# EAGLE design DDC118_eval2_rev1F (EAGLE 7.3.0)
Assembly variants: low-on-parts
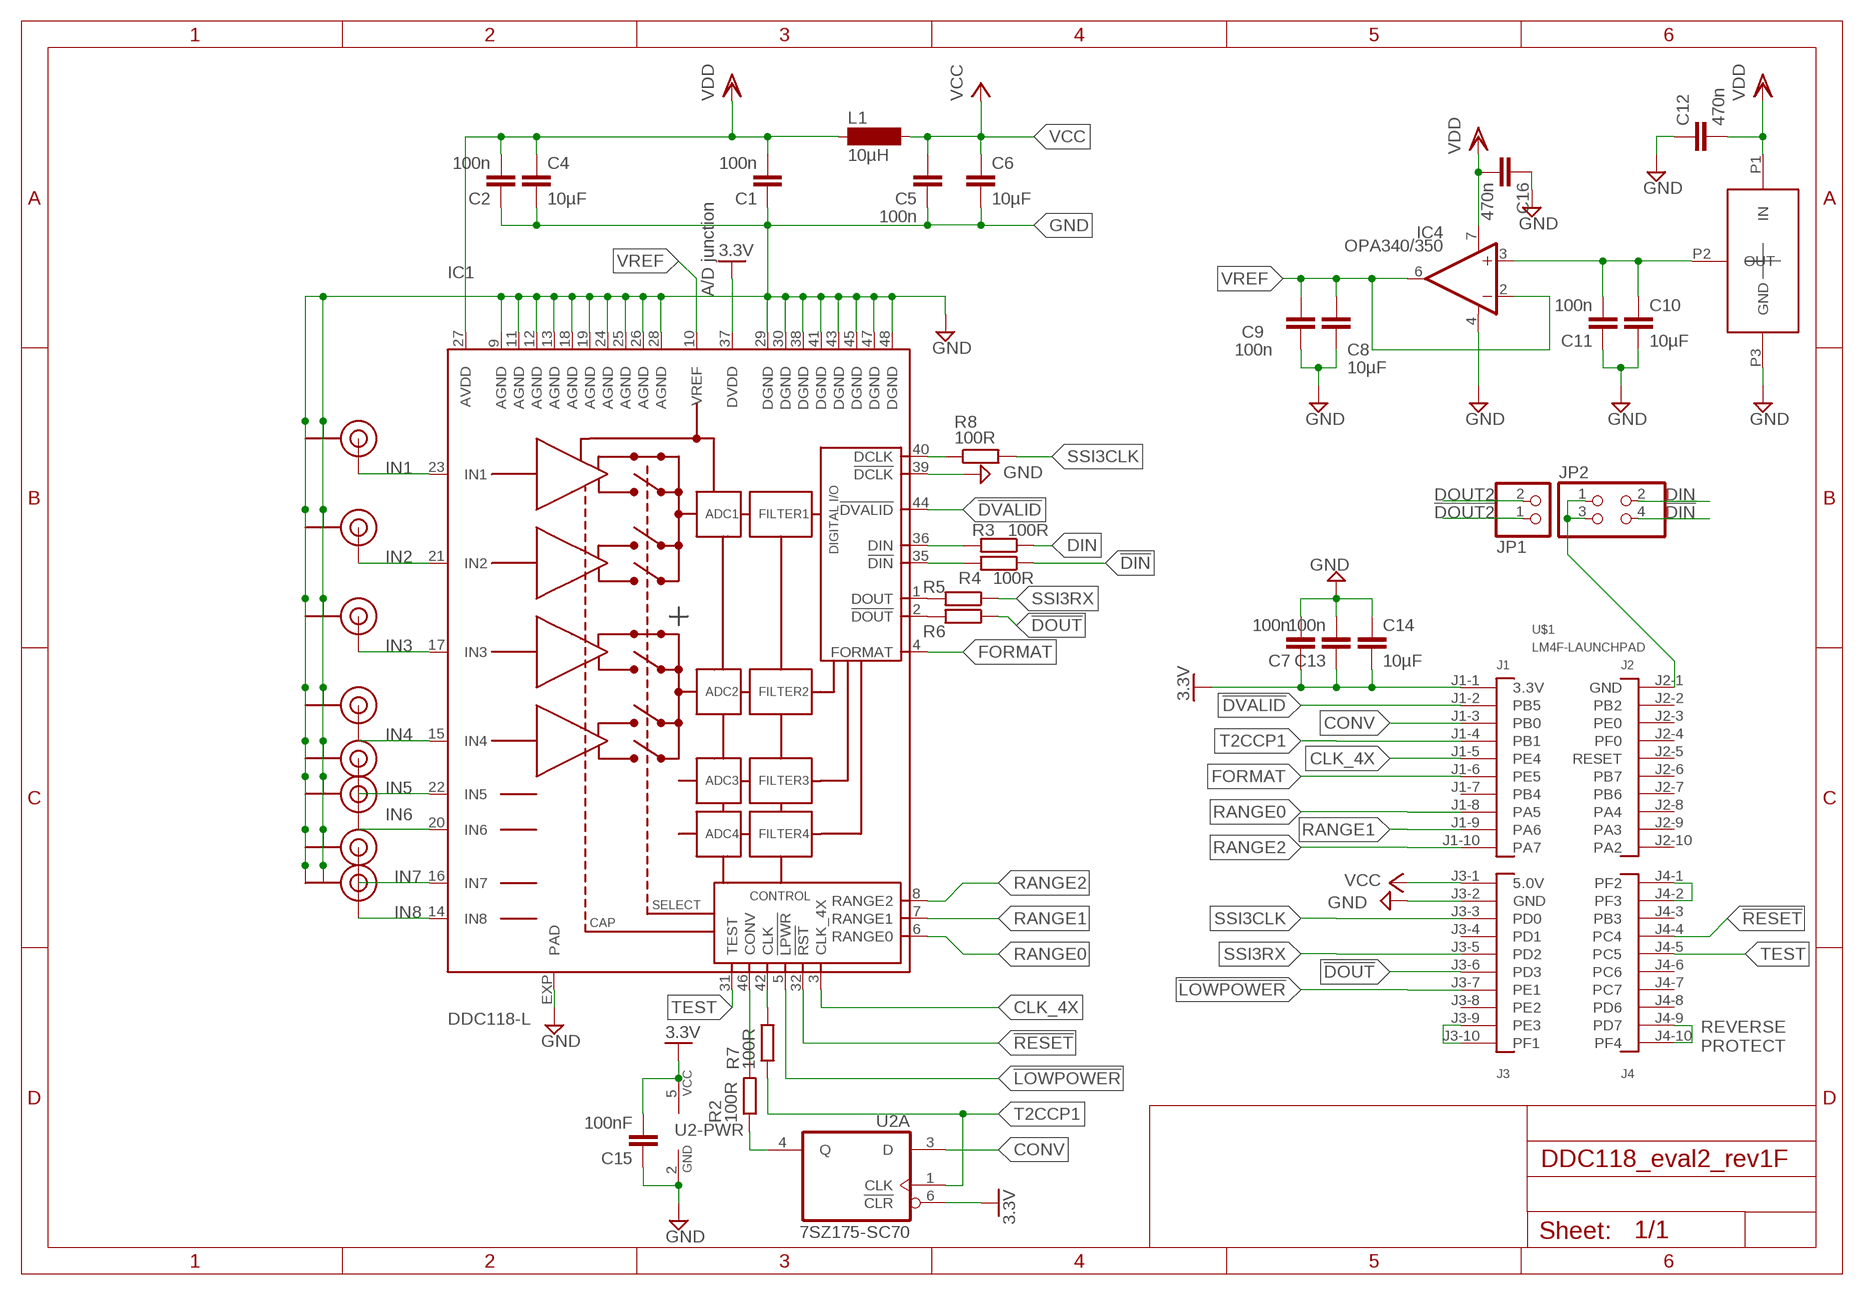
[diagram p0: schematic, sheet 1]

## Parts
C1  100n  C-EUC0805K  [C0805K]  (not fitted in variant low-on-parts)
C2  100n  C-EUC0805K  [C0805K]  (not fitted in variant low-on-parts)
C4  10µF  C-EUC0805  [C0805]  (variant low-on-parts: 4µ7)
C5  100n  C-EUC0805K  [C0805K]
C6  10µF  C-EUC0805  [C0805]  (not fitted in variant low-on-parts)
C7  100n  C-EUC0805K  [C0805K]
C8  10µF  C-EUC0805  [C0805]  (variant low-on-parts: 4µ7)
C9  100n  C-EUC0805K  [C0805K]  (not fitted in variant low-on-parts)
C10  10µF  C-EUC0805  [C0805]  (not fitted in variant low-on-parts)
C11  100n  C-EUC0805K  [C0805K]
C12  470n  C-EUC0805K  [C0805K]
C13  100n  C-EUC0805K  [C0805K]  (variant low-on-parts: 470n)
C14  10µF  C-EUC0805  [C0805]  (variant low-on-parts: 4µ7)
C15  100nF  C-EUC0603K  [C0603K]
C16  470n  CAP0805  [0805]
IC1  DDC118-L  [VQFN48-L]
IC4  OPA340/350  OPA340U  [SO08]
JP1  PINHD-1X2_2.54-SMD  [1X02SMD]
JP2  PINHD-2X2_2.54-SMD  [2X02SMD]
L1  10µH  MS50  [MS50]
R2  100R  R-EU_R0402  [R0402]
R3  100R  R-EU_R0402  [R0402]
R4  100R  R-EU_R0402  [R0402]
R5  100R  R-EU_R0402  [R0402]
R6  100R  R-EU_R0402  [R0402]
R7  100R  R-EU_R0402  [R0402]
R8  100R  R-EU_R0402  [R0402]
U1  REF30XX  [SOT-23]
U2  7SZ175-SC70  [SC-70]
U$1  LM4F-LAUNCHPAD  [LM4F120-LAUNCHPAD]
U$4  U.FL  [U.FL]
U$5  U.FL  [U.FL]
U$6  U.FL  [U.FL]
U$7  U.FL  [U.FL]
U$8  U.FL  [U.FL]
U$9  U.FL  [U.FL]
U$10  U.FL  [U.FL]
U$11  U.FL  [U.FL]

## Nets
!DIN: JP2.4 R4.1
!DOUT: R6.1 U$1.J3-6(PD3)
!DOUT2: JP1.1
!DVALID: IC1.44(!DVALID) U$1.J1-2(PB5)
!LOWPOWER: IC1.5(!LPWR) U$1.J3-7(PE1)
!RESET: IC1.32(!RST) U$1.J4-4(PC4)
+3.3V: C7.1 C13.1 C14.2 C15.2 IC1.37(DVDD) U2.5(-PWR:VCC) U2.6(A:!CLR) U$1.J1-1(3.3V) ; supply symbol labelled 3.3V
CLK_4X: IC1.3(CLK_4X) U$1.J1-5(PE4)
CONV: U2.3(A:D) U$1.J1-3(PB0)
CONV_LATCHED: IC1.46(CONV) R2.2
DIN: JP2.2 R3.1
DOUT2: JP1.2
FORMAT: IC1.4(FORMAT) U$1.J1-6(PE5)
GND: C1.1 C2.1 C4.2 C5.1 C6.2 C7.2 C8.2 C9.1 C10.2 C11.1 C12.1 C13.2 C14.1 C15.1 C16.1 IC1.9(AGND) IC1.11(AGND) IC1.12(AGND) IC1.13(AGND) IC1.18(AGND) IC1.19(AGND) IC1.24(AGND) IC1.25(AGND) IC1.26(AGND) IC1.28(AGND) IC1.29(DGND) IC1.30(DGND) IC1.38(DGND) IC1.39(!DCLK) IC1.41(DGND) IC1.43(DGND) IC1.45(DGND) IC1.47(DGND) IC1.48(DGND) IC1.EXP(PAD) IC4.4(V-) U1.P3(GND) U2.2(-PWR:GND) U$1.J3-2(GND) U$4.P$1(GND) U$4.P$2(GND) U$5.P$1(GND) U$5.P$2(GND) U$6.P$1(GND) U$6.P$2(GND) U$7.P$1(GND) U$7.P$2(GND) U$8.P$1(GND) U$8.P$2(GND) U$9.P$1(GND) U$9.P$2(GND) U$10.P$1(GND) U$10.P$2(GND) U$11.P$1(GND) U$11.P$2(GND)
IN1 [lowcap]: IC1.23(IN1) U$5.P$3(SIGNAL)
IN2 [lowcap]: IC1.21(IN2) U$6.P$3(SIGNAL)
IN3 [lowcap]: IC1.17(IN3) U$7.P$3(SIGNAL)
IN4 [lowcap]: IC1.15(IN4) U$8.P$3(SIGNAL)
IN5 [lowcap]: IC1.22(IN5) U$9.P$3(SIGNAL)
IN6 [lowcap]: IC1.20(IN6) U$4.P$3(SIGNAL)
IN7 [lowcap]: IC1.16(IN7) U$11.P$3(SIGNAL)
IN8 [lowcap]: IC1.14(IN8) U$10.P$3(SIGNAL)
N$1: R2.1 U2.4(A:Q)
N$2: JP2.1 JP2.3 U$1.J2-1(GND)
N$3: IC1.36(DIN) R3.2
N$4: IC1.35(!DIN) R4.2
N$5: IC1.1(DOUT) R5.2
N$6: IC1.2(!DOUT) R6.2
N$7: U$1.J4-9(PD7) U$1.J4-10(PF4)
N$8: U$1.J3-9(PE3) U$1.J3-10(PF1)
N$9: U$1.J4-1(PF2) U$1.J4-2(PF3)
N$11: IC1.40(DCLK) R8.1
N$12: IC1.42(CLK) R7.2
N$14: C10.1 C11.2 IC4.3(+IN) U1.P2(OUT)
RANGE0: IC1.6(RANGE0) U$1.J1-8(PA5)
RANGE1: IC1.7(RANGE1) U$1.J1-9(PA6)
RANGE2: IC1.8(RANGE2) U$1.J1-10(PA7)
SSI3CLK: R8.2 U$1.J3-3(PD0)
SSI3RX: R5.1 U$1.J3-5(PD2)
T2CCP1: R7.1 U2.1(A:CLK) U$1.J1-4(PB1)
TEST: IC1.31(TEST) U$1.J4-5(PC5)
VCC: C5.2 C6.1 L1.2 U$1.J3-1(5.0V)
VDD: C1.2 C2.2 C4.1 C12.2 C16.2 IC1.27(AVDD) IC4.7(V+) L1.1 U1.P1(IN)
VREF: C8.1 C9.2 IC1.10(VREF) IC4.2(-IN) IC4.6(OUT)
Unconnected: U$1.J1-7(PB4) U$1.J2-2(PB2) U$1.J2-3(PE0) U$1.J2-4(PF0) U$1.J2-5(RESET) U$1.J2-6(PB7) U$1.J2-7(PB6) U$1.J2-8(PA4) U$1.J2-9(PA3) U$1.J2-10(PA2) U$1.J3-4(PD1) U$1.J3-8(PE2) U$1.J4-3(PB3) U$1.J4-6(PC6) U$1.J4-7(PC7) U$1.J4-8(PD6)

## Notes on the sheet
- A/D junction
- REVERSE 
  PROTECT

## Library data of the parts
C1 C2 C4-C14 = rcl:C-EU: CAPACITOR, European symbol
C15 = resistor:C-EU: CAPACITOR, European symbol
C16 = SparkFun-Capacitors:CAP: Capacitor Standard 0603 ceramic capacitor, and 0.1" leaded capacitor.
IC1 = texas-DAS:DDC118: Octal Current Input, 20-Bit Analog-To-Digital Converter Description: The DDC118 is a 20-bit, octal channel, current-input analog-to-digital (A/D) converter. It combines both current-to-voltage and A/D conversion so that eight low-level current output devices, such as photodiodes, can be directly connected to its inputs and digitized. For each of the eight inputs, the DDC118 provides a dual-switched integrator front-end. This design allows for continuous current integration: while one integrator is being digitized by the onboard A/D converter, the other is integrating the input current. Adjustable full-scale ranges from 12pC to 350pC and adjustable integration times from 50µs to 1s allow currents from fAs to µAs to be measured with outstanding precision. Low-level linearity is ±0.5ppm of the full-scale range and noise is 5.2ppm of the full-scale range. Two modes of operation are provided. In Low-Power mode, total power dissipation is only 13.5mW per channel with a maximum data rate of 2.5kSPS. High-Speed mode supports data rates up to 3.125kSPS with a corresponding dissipation of 18mW per channel. Features: SINGLE-CHIP SOLUTION TO DIRECTLY MEASURE EIGHT LOW-LEVEL CURRENTS HIGH PRECISION, TRUE INTEGRATING FUNCTION INTEGRAL LINEARITY: ±0.01% of Reading ±0.5ppm of FSR VERY LOW NOISE: 5.2ppm of FSR LOW POWER: 13.5mW/channel ADJUSTABLE DATA RATE: Up to 3.125kSPS PROGRAMMABLE FULL SCALE DAISY-CHAINABLE SERIAL INTERFACE Datasheet: http://www.ti.com/lit/ds/symlink/ddc118.pdf Additional information: Basics of operation can be found in the DDC112 datasheet: http://www.ti.com/lit/ds/symlink/ddc112.pdf For practical daisychaining and layout considerations, consider the DDC112 evaluation board documentation: http://www.ti.com/lit/an/sbaa029/sbaa029.pdf
IC4 = burr-brown:OPA340: Rail-to-Rail Operational Amplifiers Single-Supply, MicroAmplifier(TM) Series; MPN: OPA340UA; OC_FARNELL: 1106196; OC_NEWARK: 24M5449
JP1 = pinhead-1:PINHD-1X2: PIN HEADER
JP2 = pinhead-1:PINHD-2X2: PIN HEADER
L1 = inductor-neosid:MS50: INDUCTOR SMD power inductor; OC_FARNELL: unknown; OC_NEWARK: unknown
R2-R8 = resistor:R-EU_: RESISTOR, European symbol
U1 = custom-parts:REF30XX: CMOS VOLTAGE REFERENCE: 50ppm/°C, 50µA in SOT23-3 Description: The REF30xx is a precision, low power, low voltage dropout voltage reference family available in a tiny SOT23-3. The REF30xx?s small size and low power consumption (50µA max) make it ideal for portable and battery-powered applications. The REF30xx does not require a load capacitor, but is stable with any capacitive load. Unloaded, the REF30xx can be operated with supplies within 1mV of output voltage. All models are specified for the wide temperature range, ?40°C to +125°C. Features: MicroSIZE PACKAGE: SOT23-3 LOW DROPOUT: 1mV HIGH OUTPUT CURRENT: 25mA LOW TEMPERATURE DRIFT: 50ppm/°C max HIGH ACCURACY: 0.2% LOW IQ: 50µA max Datasheet: http://www.ti.com/lit/ds/sbvs032f/sbvs032f.pdf
U2 = custom-parts:7SZ175: TinyLogic UHS D-Type Flip-Flop with Asynchronous Clear Datasheet http://www.mouser.com/ds/2/149/NC7SZ175-97987.pdf
U$1 = texas-LM4F-Launchpad:LM4F-LAUNCHPAD: Stellaris® LM4F120 LaunchPad - BoosterPack Footprint Description: The Stellaris® LM4F120 LaunchPad Evaluation Board (EK-LM4F120XL) is a low-cost evaluation platform for ARM® Cortex?-M4F-based microcontrollers. This is the 4x 10 pin main header to which add-on PCBs or mainbaords can connect. Additional Information: http://www.ti.com/lit/ug/spmu289a/spmu289a.pdf
U$4-U$11 = SparkFun-Connectors:U.FL: SMD antenna connector- WRL-09144

## Net classes
0 default: width 0.15 mm, drill 0.3 mm, clearance 0.15 mm
1 lowcap: clearance 0.4 mm

## Board
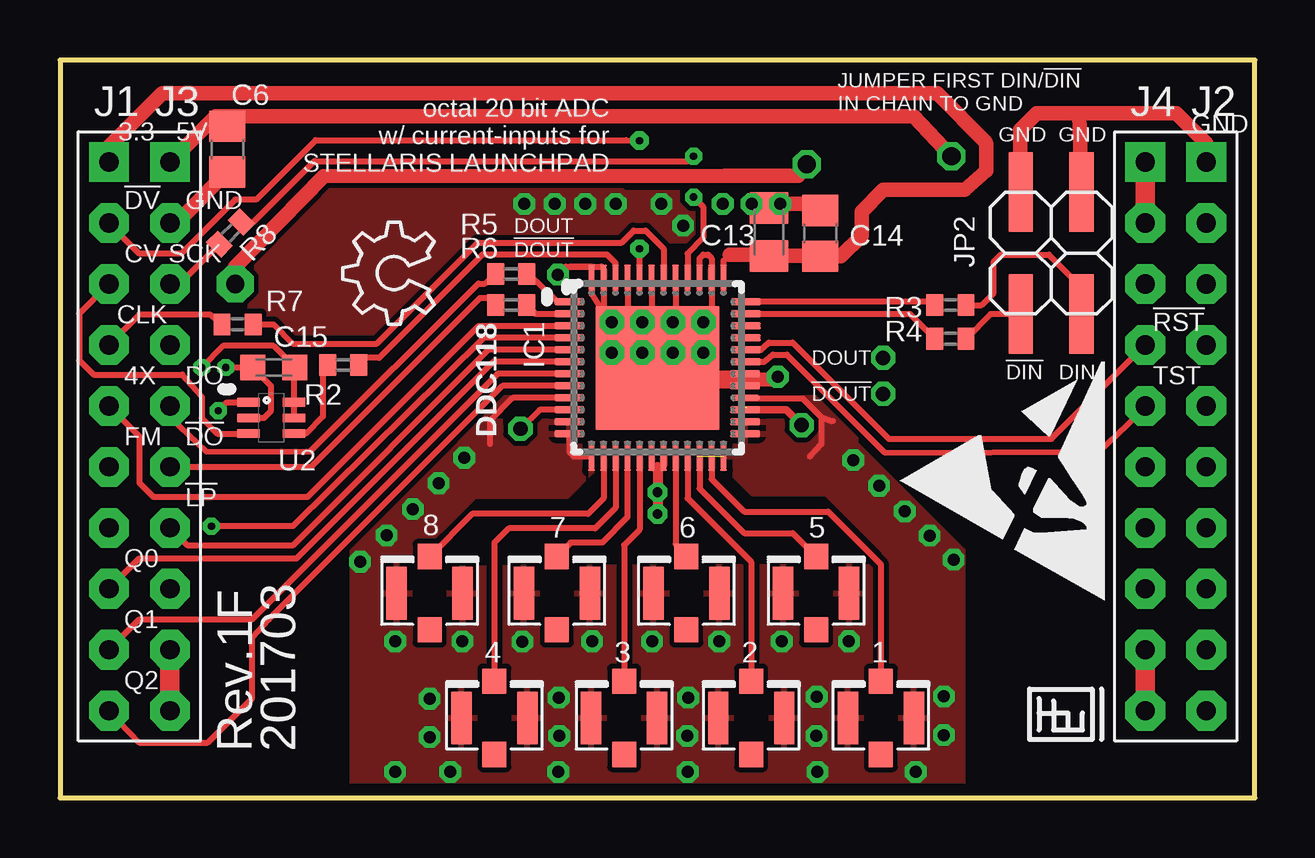
[diagram p1: board, top side]
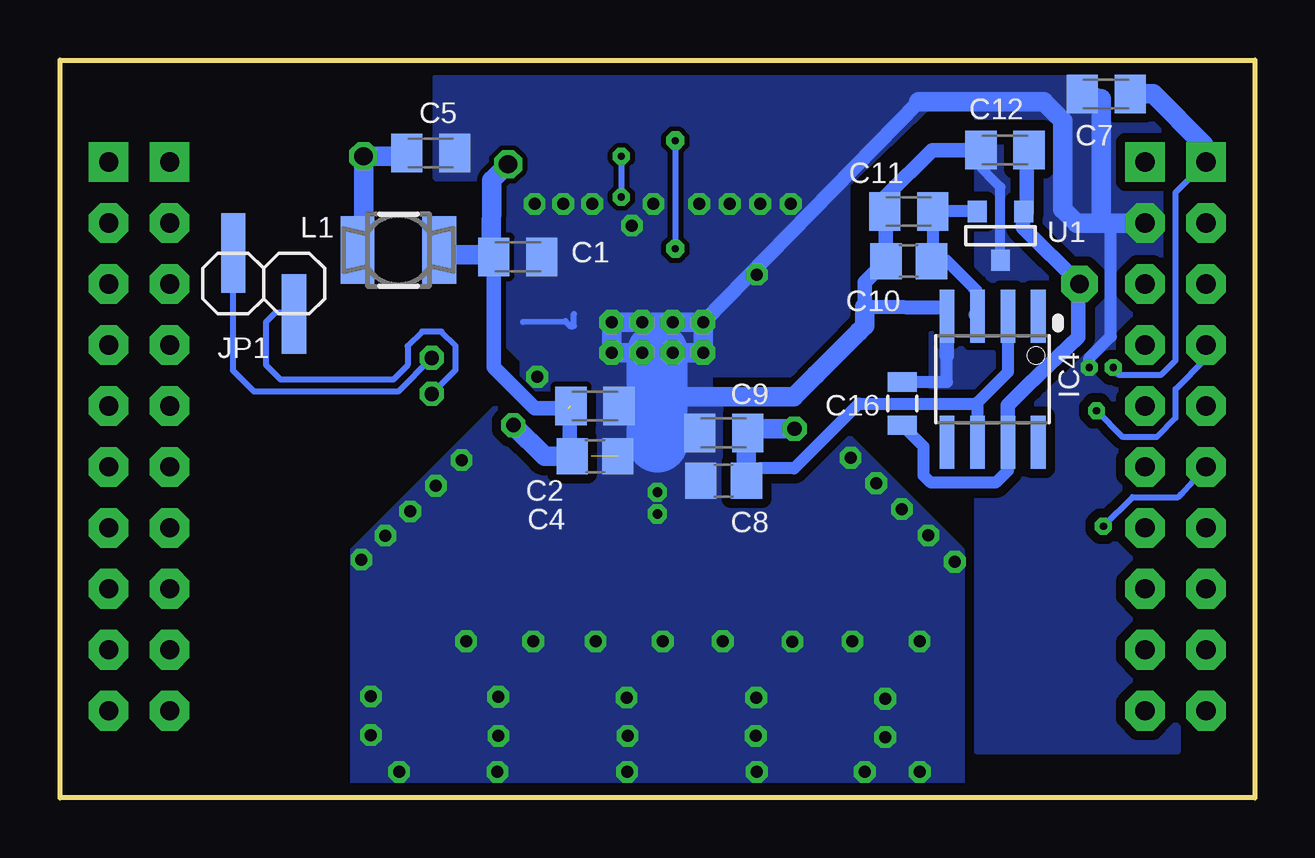
[diagram p2: board, bottom side, seen from below]

Size 49.79 x 30.74 mm. Coordinates in mm from the lower left corner, seen from the top.
Outline: 0,0 49.79,0 49.79,30.74 0,30.74 0,0
Copper layers (1*16): Top 0.035mm / dielectric 1.5mm / Bottom 0.035mm
Design rules "default *": minimum track width 10mil, minimum drill 0.4mm, track to track 8mil, track to pad 8mil, pad to pad 8mil, via to via 8mil, smd to smd 8mil, copper to edge 20mil, drill to drill 8mil, minimum pad ring 10mil, minimum via ring 8mil, stop-mask expansion 0.015mm, vias tented up to drill 0.3mm, thermal gap 10mil
tRestrict: area 14.7,7.7 to 16.1,9.2; area 20,7.7 to 21.4,9.2; area 25.4,7.7 to 26.8,9.2; area 30.8,7.7 to 32.2,9.2; area 17.4,2.8 to 18.8,4.3; area 22.8,2.8 to 24.2,4.3; area 28.1,2.8 to 29.5,4.3; area 33.5,2.8 to 34.9,4.3
bRestrict: 1 lines

### Footprints (pad centres in the part's own frame; a part is rotated, then mirrored left to right if it is on the bottom)
C0805K = smd 1.3 x 1.6: 1 -1,0; 2 1,0
C0805 = smd 1.3 x 1.5: 1 -0.95,0; 2 0.95,0
C0603K = smd 1.05 x 1.08: 1 -0.875,0; 2 0.875,0
0805 = smd 0.8 x 1.2: 1 -0.9,0; 2 0.9,0
VQFN48-L = smd 1.25 x 0.28: 1 -3.675,2.75; 2 -3.675,2.25; 3 -3.675,1.75; 4 -3.675,1.25; 5 -3.675,0.75; 6 -3.675,0.25; 7 -3.675,-0.25; 8 -3.675,-0.75; 9 -3.675,-1.25; 10 -3.675,-1.75; 11 -3.675,-2.25; 12 -3.675,-2.75; 25 3.65,-2.75; 26 3.65,-2.25; 27 3.65,-1.75; 28 3.65,-1.25; 29 3.65,-0.75; 30 3.65,-0.25; 31 3.675,0.25; 32 3.675,0.75; 33 3.675,1.25; 34 3.675,1.75; 35 3.675,2.25; 36 3.675,2.75 | smd 0.28 x 1.25: 13 -2.75,-3.675; 14 -2.25,-3.675; 15 -1.75,-3.675; 16 -1.25,-3.675; 17 -0.75,-3.675; 18 -0.25,-3.675; 19 0.25,-3.675; 20 0.75,-3.675; 21 1.25,-3.675; 22 1.75,-3.675; 23 2.25,-3.675; 24 2.75,-3.675; 37 2.75,3.675; 38 2.25,3.675; 39 1.75,3.675; 40 1.25,3.675; 41 0.75,3.675; 42 0.25,3.675; 43 -0.25,3.675; 44 -0.75,3.675; 45 -1.25,3.675; 46 -1.75,3.675; 47 -2.25,3.675; 48 -2.75,3.675 | smd 5.15 x 5.15: EXP 0,0
SO08 = smd 0.61 x 2.21: 1 -1.905,-2.616; 2 -0.635,-2.616; 3 0.635,-2.616; 4 1.905,-2.616; 5 1.905,2.616; 6 0.635,2.616; 7 -0.635,2.616; 8 -1.905,2.616
1X02SMD = smd 1.016 x 3.302: 1 -1.27,1.27; 2 1.27,-1.27
2X02SMD = smd 1.016 x 3.302: 1 -1.27,-3.81; 2 -1.27,1.27; 3 1.27,-3.81; 4 1.27,1.27
MS50 = smd 2.8 x 1.4: 1 0,-1.7; 2 0,1.7
R0402 = smd 0.7 x 0.9: 1 -0.65,0; 2 0.65,0
SOT-23 = smd 0.787 x 0.889: P1 -0.991,-1.016; P2 0.94,-1.016; P3 -0.025,1.016
SC-70 = smd 0.36 x 0.95: 1 -0.65,-0.95; 2 0,-0.95; 3 0.65,-0.95; 4 0.65,0.95; 5 0,0.95; 6 -0.65,0.95
LM4F120-LAUNCHPAD = drill 0.8 pad 1.651 square: J1-1 2.54,35.56; J2-1 48.26,35.56; J3-1 5.08,35.56; J4-1 45.72,35.56 | drill 0.8 pad 1.651 octagon: J1-2 2.54,33.02; J1-3 2.54,30.48; J1-4 2.54,27.94; J1-5 2.54,25.4; J1-6 2.54,22.86; J1-7 2.54,20.32; J1-8 2.54,17.78; J1-9 2.54,15.24; J1-10 2.54,12.7; J2-2 48.26,33.02; J2-3 48.26,30.48; J2-4 48.26,27.94; J2-5 48.26,25.4; J2-6 48.26,22.86; J2-7 48.26,20.32; J2-8 48.26,17.78; J2-9 48.26,15.24; J2-10 48.26,12.7; J3-2 5.08,33.02; J3-3 5.08,30.48; J3-4 5.08,27.94; J3-5 5.08,25.4; J3-6 5.08,22.86; J3-7 5.08,20.32; J3-8 5.08,17.78; J3-9 5.08,15.24; J3-10 5.08,12.7; J4-2 45.72,33.02; J4-3 45.72,30.48; J4-4 45.72,27.94; J4-5 45.72,25.4; J4-6 45.72,22.86; J4-7 45.72,20.32; J4-8 45.72,17.78; J4-9 45.72,15.24; J4-10 45.72,12.7
U.FL = smd 2.2 x 0.85: P$1 0,1.375; P$2 0,-1.375 | smd 1.05 x 1: P$3 1.525,0; P$4 -1.525,0

### Placement (x,y rotation side)
C1  30.71,22.54 180 bottom
C2  27.5,16.33 180 bottom
C4  27.5,14.23 0 bottom
C5  34.34,26.87 180 bottom
C6  6.98,27.02 270 top
C7  6.2,29.33 180 bottom
C8  22.13,13.21 180 bottom
C9  22.13,15.2 0 bottom
C10  14.42,22.36 180 bottom
C11  14.42,24.42 0 bottom
C12  10.41,26.99 0 bottom
C13  29.54,23.58 90 top
C14  31.67,23.52 270 top
C15  8.9,17.93 0 top
C16  14.7,16.43 270 bottom
IC1  24.9,17.91 0 top
IC4  10.93,17.44 180 bottom
JP1  41.3,21.43 180 bottom
JP2  41.3,21.43 180 top
L1  35.68,22.82 90 bottom
R2  11.8,18.03 0 top
R3  37.1,20.53 180 top
R4  37.1,19.13 180 top
R5  18.8,21.83 0 top
R6  18.8,20.53 0 top
R7  7.4,19.73 0 top
R8  7.1,23.53 225 top
U1  10.63,23.41 180 bottom
U2  8.8,15.83 270 top
U$1  -0.5,-9.07 0 top
U$2  [OSHW_6X150_NOTEXT]  15.6,19.73 90 top
U$3  [ESD_10.00]  43.6,8.13 90 top
U$4  26.1,8.53 90 top
U$5  34.2,3.33 90 top
U$6  28.8,3.33 90 top
U$7  23.5,3.33 90 top
U$8  18.1,3.33 90 top
U$9  31.5,8.53 90 top
U$10  15.4,8.53 90 top
U$11  20.7,8.53 90 top

### Tracks (layer width: path | path; a pad name or v marks a point on that pad's centre or on a via)
!DIN
  Top 0.254: R4.1 38.78,20.16 JP2.4
!DOUT
  Top 0.254: U$1.J3-6 10.46,13.79 17.5,20.83 17.85,20.83 R6.1
!DOUT2  (via drill 0.6 pad 0.89)
  Bottom 0.254: v34.3,16.83 33.3,17.83 33.3,18.83 33.9,19.43 34.7,19.43 35.3,18.83 35.3,18.03 35.9,17.43 40.6,17.43 41.2,18.03 41.2,19.83 40.8,20.23 39.96,20.23 JP1.1
!DVALID  (via drill 0.3 pad 0.76)
  Top 0.254: IC1.44 v24.15,22.88 | U$1.J1-2 3.31,22.68 5.05,22.68 7.3,24.93 8.18,24.93 10.65,27.4 23.59,27.4 v24.15,27.38
  Bottom 0.254: v24.15,27.38 v24.15,22.88
!LOWPOWER
  Top 0.254: IC1.5 17.85,18.67 9.71,10.53 5.3,10.53 U$1.J3-7
!RESET
  Top 0.254: IC1.32 29.2,18.67 29.54,18.97 30.52,18.97 34.53,14.96 41.31,14.96 U$1.J4-4
+3.3V  (via drill 0.3)
  Top 0.254: U2.5 U2.6 9.75,17.9 C15.2 | 9.85,17.85 C15.2 | v5.9,17.93 6.8,18.83 8.9,18.83 9.78,17.95 C15.2 | IC1.37 27.65,22.38 27.9,22.63
  Top 0.61: U$1.J1-1 2.04,27.12 4.26,29.34 36.55,29.34 38.57,27.32 38.6,27.25 38.6,26.13 37.7,25.33 34.3,25.33 33.4,24.43 33.4,23.43 32.54,22.57 C14.2 C13.1 29.49,22.63 27.9,22.63
  Bottom 0.254: v5.9,17.93 5.7,17.63 3.9,17.63 3.3,18.23 3.3,25.23 U$1.J1-1
  Bottom 0.813: C7.1 4.25,29.33 2.12,27.21 2.12,26.57 U$1.J1-1
CLK_4X
  Top 0.254: U$1.J1-5 3.31,15.06 3.31,13.12 3.9,12.53 10.3,12.53 17.44,19.67 IC1.3
CONV
  Top 0.254: U$1.J1-3 0.8,20.17 0.8,18.23 1.4,17.63 5.1,17.63 5.9,16.73 5.9,15.83 6.55,15.18 U2.3
CONV_LATCHED
  Top 0.254: IC1.46 23.15,22.28 22.8,22.63 17.6,22.63 13.3,18.33 12.6,18.33 12.6,17.93 R2.2
DIN
  Top 0.254: R3.1 38.4,20.53 38.9,21.03 38.9,22.33 39.2,22.63 41.2,22.63 42.57,21.26 JP2.2
DOUT2  (via drill 0.6 pad 0.89)
  Bottom 0.254: v34.3,18.33 35.7,16.93 41.7,16.93 42.57,17.8 JP1.2
FORMAT  (via drill 0.3 pad 0.7)
  Top 0.254: IC1.4 17.66,19.17 9.71,11.32 v6.31,11.32
  Bottom 0.254: v6.31,11.32 5.1,12.53 3.2,12.53 3.1,12.63 U$1.J1-6
GND  (via drill 0.3, 0.4 pad 0.6, 0.5 pad 0.7, 0.5 pad 0.76, 0.5 pad 1.02)  (1 unrouted)
  Top 0.254: IC1.18 24.65,13.79 24.9,13.79 | IC1.47 22.65,20.17 22.68,20.14 | IC1.48 22.15,20.98 22.68,20.14 | 22.68,20.14 v23,19.82 | v23,19.82 23.31,19.5 | 23.31,19.5 v24.27,18.55 IC1.EXP | IC1.45 23.65,19.84 | 23.65,19.84 23.31,19.5 | IC1.43 24.65,20.2 | 24.65,20.2 v24.27,19.82 23.67,19.82 23.65,19.84 | IC1.41 25.65,20.25 | 25.65,20.25 25.54,20.14 | 25.54,20.14 24.72,20.14 24.65,20.2 | IC1.38 27.15,20.17 v26.8,19.82 26.08,19.82 25.65,20.25 | IC1.30 26.74,17.67 | 26.49,17.6 26.55,17.67 26.74,17.67 | 26.49,17.6 25.22,17.6 IC1.EXP | IC1.29 26.92,17.17 26.8,17.28 | 26.8,17.28 26.49,17.6 | 26.79,16.67 26.49,16.96 26.49,17.6 | 26.74,17.67 26.8,17.6 | 26.8,17.6 26.8,17.28 | 26.8,17.28 25.54,17.28 v25.54,18.55 | IC1.EXP 24.27,17.28 | v23,18.55 v23,19.82 | v26.8,18.55 26.8,17.6 | v25.54,19.82 25.54,20.14 | IC1.9 18.87,16.67 17.91,15.69 17.91,14.74 | 31.73,15.85 31.73,14.74 31.25,14.22 | 31.73,15.85 32.2,15.69 | IC1.28 28.37,16.65 30.93,16.65 31.73,15.85 | 22.65,21.57 22.65,22.04 22.57,22.13 21.07,22.13 v20.75,21.8 21.23,22.13 22.2,22.13 | 27.12,22.04 27.12,21.57 | IC1.38 27.15,21.54 27.12,21.57 | 27.12,21.57 27.12,21.41 | U2.2 8.5,15.83 8.8,16.13 8.8,17.15 C15.1 v6.9,17.93 | IC1.39 26.65,22.48 26.8,22.63 27,22.63 27.15,22.48 IC1.38 | IC1.12 21.23,14.4 21.4,14.23 22.14,14.23 IC1.13
  Top 0.305: IC1.19 25.15,13.88 24.9,13.63
  Top 0.406: 24.9,13.79 24.9,13.63 v24.9,11.83
  Top 0.61: v29.9,17.54 30,17.53 29.9,17.43 27.12,17.44 | C6.2 4.85,23.95 U$1.J3-2 | C14.1 31.4,24.74 v30.01,24.74 | v30.01,24.74 v28.81,24.74 | v30.01,24.74 29.85,24.58 C13.2
  Top 0.813: 27.12,17.44 26.8,17.76 v26.8,18.55
  Bottom 0.254: 30.5,19.83 28.73,19.86 28.5,19.63 28.38,19.66 28.38,20.17
  Bottom 0.406: U1.P3 10.6,25.44 11.63,26.47
  Bottom 0.508: IC4.4 12.84,20.36 12.9,20.43 | v6.9,17.93 6.9,18.33 6,19.23 6,23.85 6.1,23.95 | C16.1 12.84,17.33 12.84,19.53
  Bottom 0.61: 14.01,29.01 v23,19.82 | 12.9,20.43 16.25,20.45 16.25,21.48 C10.2 15.37,24.37 C11.1 15.38,24.47 15.38,25.06 13.45,26.99 C12.1 11.63,26.47 | 12.84,18.41 12.84,19.53 IC4.4
  Bottom 0.813: 24.9,16.53 24.9,16.63 24.62,16.7 19.22,16.7 18.3,17.63 16.5,19.41 16.25,19.66 16.25,20.45 | 14.01,29.01 8.8,29.01 8,28.21 8,24.53 7.42,23.95 6.4,23.95 | 6.4,23.95 6.1,23.95 U$1.J3-2 | C7.2 6.4,29.13 6.4,23.95 | 24.9,18.55 v25.54,18.55 v26.8,18.55 v26.8,19.82 v25.54,19.82 v24.27,19.82 v23,19.82 v23,18.55 v24.27,18.55 24.9,18.55
  Bottom 2.54: 24.9,14.83 24.9,16.53 24.9,18.55
  other vias: 33.05,14.07 34.12,13 35.2,11.93 36.23,10.92 36.83,4.22 36.83,2.62 31.53,4.21 31.52,2.58 26.18,4.18 26.14,2.58 20.8,2.58 15.4,2.53 15.4,4.13 20.78,4.18 16.84,14.17 15.77,13.1 14.71,12.03 22.17,6.53 32.87,6.52 16.77,6.52 19.27,6.51 19.34,24.74 20.61,24.74 21.88,24.74 23.15,24.74 25.06,24.74 25.96,23.84 13.97,6.52 24.67,6.52 27.47,6.52 30.07,6.52 13.61,10.93 37.23,9.92 12.51,9.83 13.96,1.08 16.26,1.08 20.76,1.08 26.16,1.08 31.56,1.08 35.66,1.08 27.61,24.74 24.9,12.73
  pour Top: 17.6,15.69 21.73,15.69 21.73,14.74 22.14,14.74 22.14,13.59 21.12,12.57 17.25,12.57 14.34,9.66 14.24,9.57 34.36,9.67 34.36,10.26 31.95,12.67 28.88,12.67 27.76,13.79 27.76,14.74 28.07,14.74 28.07,15.69 32.2,15.69 37.6,10.29 37.6,0.24 12.2,0.24 12.2,10.29
  pour Bottom (isolate 0.381, no thermals): 18.1,16.19 31.7,16.19 37.6,10.29 37.6,2.04 12.2,2.04 12.2,10.29
  pour Bottom (no thermals): 17.07,25.58 17.07,20.12 19,18.13 19.41,17.72 22.8,17.72 22.81,14 27.2,14.1 27.24,17.13 30.41,17.13 30.41,18.24 30.9,18.73 31.57,19.38 31.57,25.88 34.05,25.87 34.05,29.99 13.63,29.99 7.3,29.93 7.3,28.96 13.63,28.96 13.6,28.93
  pour Top: 17.91,15.69 17.6,15.69 16.64,14.74 16.64,15.85 17.44,16.66 18.87,16.66
  pour Top: 30.93,16.65 31.73,15.85 31.73,14.74 33.16,14.74 33.16,15.69 32.2,16.65
  pour Bottom: 13.15,19.66 12.52,19.66 12.36,19.5 12.36,18.87 12.04,18.55 10.93,18.55 10.93,17.44 11.25,17.12 13.47,17.12 13.47,19.34
  pour Top (isolate 0.203): 12.1,26.19 22.7,26.19 23.47,25.22 26.64,25.22 26.64,23.21 24.24,23.21 18.03,23.21 14.1,19.38 7.38,19.38 7.34,20.41 7.34,21.34
  pour Bottom (isolate 0.381, no thermals): 3.2,28.79 3.2,28.89 11.6,28.9 11.6,1.94 3.2,1.94 3.3,22.9
  pour Bottom (isolate 0.381, no thermals): 18.1,14.39 31.7,14.39 37.6,8.49 37.6,0.24 12.2,0.24 12.2,8.49
IN1
  Top 0.254: IC1.23 27.15,13.28 28.5,11.93 32,11.93 34.2,9.73 U$5.P$3
IN2
  Top 0.254: IC1.21 26.15,12.48 28.8,9.83 U$6.P$3
IN3
  Top 0.254: IC1.17 24.15,11.18 23.5,10.53 U$7.P$3
IN4
  Top 0.254: IC1.15 23.15,12.08 22.3,11.23 18.7,11.23 18.1,10.63 U$8.P$3
IN5
  Top 0.254: IC1.22 26.65,12.88 28.5,11.03 30.52,11.03 U$9.P$3
IN6
  Top 0.254: IC1.20 25.65,10.58 26.2,10.03 26.2,10.15 U$4.P$3
IN7
  Top 0.254: IC1.16 23.65,11.7 22.6,10.63 21.27,10.63 U$11.P$3
IN8
  Top 0.254: IC1.14 22.65,12.48 22,11.83 17.18,11.83 U$10.P$3
N$1
  Top 0.254: R2.1 11,17.63 10.95,17.58 10.95,15.88 10.25,15.18 U2.4
N$2
  Top 0.61: U$1.J2-1 47.76,27.27 46.5,28.53 42.4,28.53 | 42.4,28.53 40.7,28.53 40,27.83 40,25.41 JP2.3 | JP2.1 42.47,28.46 42.4,28.53
N$3
  Top 0.254: R3.2 36.31,20.67 IC1.36
N$4
  Top 0.254: IC1.35 35.41,20.17 R4.2
N$5
  Top 0.254: R5.2 19.5,21.83 20.71,20.67 IC1.1
N$6
  Top 0.254: R6.2 19.81,20.17 IC1.2
N$7
  Top 0.813: U$1.J4-9 U$1.J4-10
N$8
  Top 0.813: U$1.J3-9 U$1.J3-10
N$9
  Top 0.813: U$1.J4-1 U$1.J4-2
N$11  (via drill 0.3)
  Top 0.254: R8.1 8.06,23.99 10.6,26.53 26.2,26.53 v26.4,26.73 | v26.4,25.03 26.8,24.63 26.8,23.33 26.15,22.68 IC1.40
  Bottom 0.254: v26.4,26.73 v26.4,25.03
N$12
  Top 0.254: R7.2 8.9,19.73 9.7,18.93 13.2,18.93 17.4,23.13 23.4,23.13 23.9,23.63 24.4,23.63 25.15,22.88 IC1.42
N$14
  Bottom 0.508: U1.P2 C11.2 13.42,22.41 | 13.42,22.41 C10.1 | 13.42,22.41 12.88,22.41 11.7,21.23 11.6,21.13 11.6,20.09 IC4.3
  Bottom 0.61: 13.42,22.41 C10.1 | 11.63,20.12 IC4.3
RANGE0
  Top 0.254: IC1.6 18.04,18.17 9.86,9.98 3.31,9.98 U$1.J1-8
RANGE1
  Top 0.254: IC1.7 18.24,17.67 8.01,7.44 3.31,7.44 U$1.J1-9
RANGE2
  Top 0.254: IC1.8 18.43,17.17 8.7,7.44 8,6.69 8,4.53 8,4.15 6.15,2.3 3.31,2.3 U$1.J1-10
SSI3CLK
  Top 0.254: R8.2 4.98,21.41 U$1.J3-3
SSI3RX
  Top 0.254: U$1.J3-5 4.57,15.83 4.59,15.83 6.1,14.43 10.44,14.43 17.43,21.43 17.7,21.43 18.1,21.83 R5.1
T2CCP1  (via drill 0.3)
  Top 0.254: v6.6,16.13 6.95,16.48 U2.1 | R7.1 6.25,20.13 3.3,20.13 U$1.J1-4
  Bottom 0.254: v6.6,16.13 5.5,15.03 4.1,15.03 3.3,15.83 3.3,17.03 2.04,18.29 U$1.J1-4
TEST
  Top 0.254: IC1.31 29.34,18.17 29.7,18.47 30.29,18.47 34.37,14.38 43.3,14.43 45.25,16.28 45.27,16.28 U$1.J4-5
VCC  (via drill 0.76 pad 1)
  Top 0.61: 6.75,28.39 C6.1 | 6.75,28.39 35.58,28.39 v37.14,26.73 | U$1.J3-1 6.49,28.39 6.75,28.39
  Bottom 0.813: C5.2 35.78,26.73 v37.14,26.73 37.14,22.98 L1.2
VDD  (via drill 0.6, 0.76 pad 1, 0.76 pad 1.52)  (1 unrouted)
  Top 0.305: IC1.27 30.26,16.17 v30.9,15.53
  Top 0.61: v7.3,21.41 7.3,22.13 10.99,25.9 27.7,25.93 30.75,25.93 v31.12,26.4
  Bottom 0.508: IC4.7 10.29,13.63 10.8,13.13 13.5,13.13 13.8,13.43 13.8,14.63 C16.2
  Bottom 0.61: IC4.7 10.29,16.35 9.46,17.19 7.36,19.19 7.36,20.76 v7.3,21.41 9.67,23.78 U1.P1 9.5,24.37 9.5,26.49 C12.2 | C4.1 28.55,14.33 IC1.27 28.61,16.23 30,16.23 31.71,17.94 C1.2
  Bottom 0.813: L1.1 33.66,22.7 33.76,22.63 31.82,22.63 C1.2 31.82,22.65 31.8,25.73 31.13,26.4 v31.12,26.4 | 28.7,16.53 C2.2 | C4.1 29.6,14.23 v30.9,15.53
VREF  (via drill 0.6 pad 1.02)
  Top 0.254: IC1.10 19.98,16.17 v19.18,15.38
  Bottom 0.508: C8.1 20.66,13.73 19.2,13.73 16.5,16.43 11.66,16.43 11.56,16.33 | IC4.2 10.29,17.73 11.56,16.46 11.56,16.33 | 11.56,16.33 IC4.6
  Bottom 0.813: v19.18,15.38 20.96,15.38 C9.2 21.18,15.15 C8.1

### Text on the board
tPlace: octal 20 bit ADC / w/ current-inputs for / STELLARIS LAUNCHPAD | DDC118 | Rev.1F | 201703
tNames: JUMPER FIRST DIN/!DIN / IN CHAIN TO GND | 3.3 | 5V | GND | GND | GND | !DV! | GND | DOUT | CV | SCK | !DOUT | CLK | !RST! | 4X | DO | DOUT | TST | !DOUT | !DIN | DIN | FM | !DO! | !LP | 8 | 7 | 6 | 5 | Q0 | Q1 | 4 | 3 | 2 | 1 | Q2